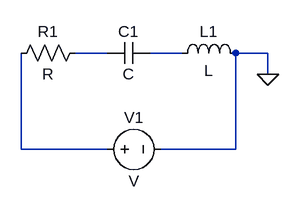
[diagram p0: schematic RLC.asc]
RLC.asc, the LTspice schematic file:
Version 4
SHEET 1 880 680
WIRE 144 192 96 192
WIRE 256 192 208 192
WIRE 384 192 336 192
WIRE 384 224 384 192
WIRE 16 336 16 192
WIRE 144 336 16 336
WIRE 336 336 336 192
WIRE 336 336 224 336
FLAG 384 224 0
SYMBOL res 112 176 R90
WINDOW 0 0 56 VBottom 2
WINDOW 3 32 56 VTop 2
SYMATTR InstName R1
SYMBOL cap 208 176 R90
WINDOW 0 0 32 VBottom 2
WINDOW 3 32 32 VTop 2
SYMATTR InstName C1
SYMBOL ind 240 208 R270
WINDOW 0 32 56 VTop 2
WINDOW 3 5 56 VBottom 2
SYMATTR InstName L1
SYMBOL voltage 128 336 R270
WINDOW 0 32 56 VTop 2
WINDOW 3 -32 56 VBottom 2
SYMATTR InstName V1

The netlist it stands for:
* RLC.asc
R1 N001 N003 R
C1 N002 N001 C
L1 N002 0 L
V1 N003 0 V
.backanno
.end